# EAGLE schematic Circuito_elétrico_Atividades04 (EAGLE 9.6.2)
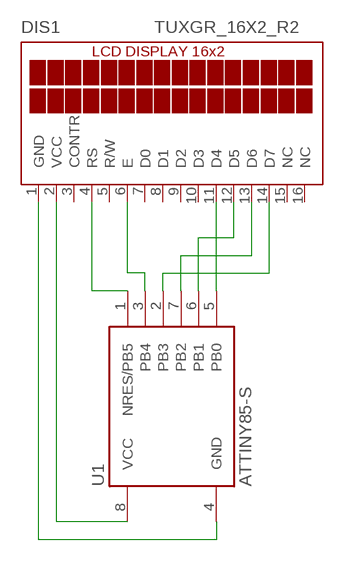
[diagram p0: schematic, sheet 1]

## Parts
DIS1  TUXGR_16X2_R2  [TUXGR_16X2_R2]
U1  ATTINY85-S  [SOIC8_EIAJ_208MIL]

## Nets
N$1: DIS1.4(RS) U1.1(NRES/PB5)
N$2: DIS1.6(E) U1.3(PB4)
N$3: DIS1.14(D7) U1.2(PB3)
N$4: DIS1.13(D6) U1.7(PB2)
N$5: DIS1.12(D5) U1.6(PB1)
N$6: DIS1.11(D4) U1.5(PB0)
N$7: DIS1.2(VCC) U1.8(VCC)
N$8: DIS1.1(GND) U1.4(GND)
Unconnected: DIS1.3(CONTR) DIS1.5(R/W) DIS1.7(D0) DIS1.8(D1) DIS1.9(D2) DIS1.10(D3) DIS1.15(NC) DIS1.16(NC)

## Library data of the parts
DIS1 = display-lcd:TUXGR_16X2_R2: Tuxgraphics LCD display 16x2 characters reflective, without background light Source: tuxgr_12x2_r2.pdf; OC_FARNELL: unknown; OC_NEWARK: unknown
U1 = _hhn_attiny25_45_85:ATTINY85*: ATMEL ATtiny 85 Packages: P = PDIP 08 30mil S = SOIC 08 EIAJ 208mil Technologies Note: for complete ordering code (temp. range, finish, tape&reel etc.) see www.atmel.com • Supply Voltage: V = (1.8…5.5)V | [blank] = (2.7…5.5)V • Speed: 10 = 10 MHz | 20 = 20 MHz Author: Dipl.-Ing. FH Rainer Bayer HHN Hochschule Heilbronn (Heilbronn University), rainer.bayer@hs-heilbronn.de Ingenieurbüro ing-rb, mail@ing-rb.de